# EAGLE design TFT_adapter (EAGLE 7.7.0)
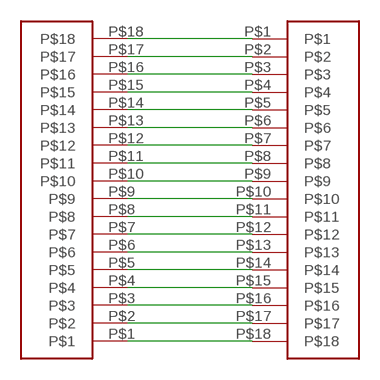
[diagram p0: schematic, sheet 1]

## Parts
U$1  FCC-18-1.0MM  [FFC-18-1.0MM]
U$2  FCC-18-0.8MM  [FFC-18-0.8MM]

## Nets
N$1: U$1.P$18 U$2.P$1
N$2: U$1.P$17 U$2.P$2
N$3: U$1.P$16 U$2.P$3
N$4: U$1.P$15 U$2.P$4
N$5: U$1.P$14 U$2.P$5
N$6: U$1.P$13 U$2.P$6
N$7: U$1.P$12 U$2.P$7
N$8: U$1.P$11 U$2.P$8
N$9: U$1.P$10 U$2.P$9
N$10: U$1.P$9 U$2.P$10
N$11: U$1.P$8 U$2.P$11
N$12: U$1.P$7 U$2.P$12
N$13: U$1.P$6 U$2.P$13
N$14: U$1.P$5 U$2.P$14
N$15: U$1.P$4 U$2.P$15
N$16: U$1.P$3 U$2.P$16
N$17: U$1.P$2 U$2.P$17
N$18: U$1.P$1 U$2.P$18

## Library data of the parts
U$1 = custom:FCC-18-1.0MM
U$2 = custom:FCC-18-0.8MM

## Board
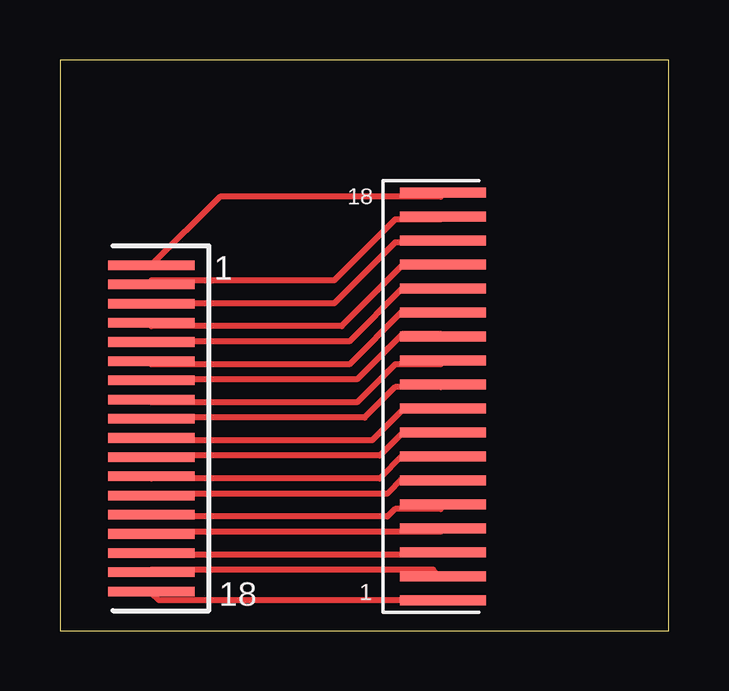
[diagram p1: board, top side]

Size 25.38 x 23.8 mm. Coordinates in mm from the lower left corner, seen from the top.
Outline: 0,0 25.38,0 25.38,23.8 0,23.8 0,0
Copper layers (1*16): Top 0.035mm / dielectric 1.5mm / Bottom 0.035mm
Design rules "default *": minimum track width 10mil, minimum drill 24mil, track to track 12mil, track to pad 12mil, pad to pad 12mil, via to via 12mil, smd to smd 12mil, copper to edge 40mil, drill to drill 8mil, minimum pad ring 10mil, minimum via ring 8mil, stop-mask expansion 4mil, vias tented up to drill 0mil, thermal gap 10mil

### Footprints (pad centres in the part's own frame; a part is rotated, then mirrored left to right if it is on the bottom)
FFC-18-1.0MM = smd 3.6 x 0.4: P$1 2,0; P$2 2,1; P$3 2,2; P$4 2,3; P$5 2,4; P$6 2,5; P$7 2,6; P$8 2,7; P$9 2,8; P$10 2,9; P$11 2,10; P$12 2,11; P$13 2,12; P$14 2,13; P$15 2,14; P$16 2,15; P$17 2,16; P$18 2,17
FFC-18-0.8MM = smd 3.6 x 0.4: P$1 0,0; P$2 0,0.8; P$3 0,1.6; P$4 0,2.4; P$5 0,3.2; P$6 0,4; P$7 0,4.8; P$8 0,5.6; P$9 0,6.4; P$10 0,7.2; P$11 0,8; P$12 0,8.8; P$13 0,9.6; P$14 0,10.4; P$15 0,11.2; P$16 0,12; P$17 0,12.8; P$18 0,13.6

### Placement (x,y rotation side)
U$1  13.97,1.27 0 top
U$2  3.81,15.24 180 top

### Tracks (layer width: path | path; a pad name or v marks a point on that pad's centre or on a via)
N$1
  Top 0.254: U$2.P$1 6.67,18.1 15.88,18.1 U$1.P$18
N$2
  Top 0.254: U$2.P$2 3.81,14.61 11.43,14.61 13.97,17.14 15.88,17.14 U$1.P$17
N$3
  Top 0.254: U$2.P$3 3.81,13.65 11.43,13.65 13.97,16.19 15.88,16.19 U$1.P$16
N$4
  Top 0.254: U$2.P$4 3.81,12.7 11.75,12.7 14.29,15.24 15.88,15.24 U$1.P$15
N$5
  Top 0.254: U$2.P$5 3.81,12.06 12.06,12.06 14.29,14.29 15.88,14.29 U$1.P$14
N$6
  Top 0.254: U$2.P$6 3.81,11.11 12.06,11.11 14.29,13.34 15.88,13.34 U$1.P$13
N$7
  Top 0.254: U$2.P$7 3.81,10.48 12.38,10.48 14.29,12.38 15.88,12.38 U$1.P$12
N$8
  Top 0.254: U$2.P$8 3.81,9.53 12.38,9.53 13.97,11.11 15.88,11.11 U$1.P$11
N$9
  Top 0.254: U$2.P$9 3.81,8.89 12.7,8.89 13.97,10.16 15.88,10.16 U$1.P$10
N$10
  Top 0.254: U$2.P$10 3.81,7.94 13.02,7.94 14.29,9.21 15.88,9.21 U$1.P$9
N$11
  Top 0.254: U$2.P$11 3.81,7.3 13.34,7.3 14.29,8.26 15.88,8.26 U$1.P$8
N$12
  Top 0.254: U$2.P$12 3.81,6.35 13.34,6.35 14.29,7.3 15.88,7.3 U$1.P$7
N$13
  Top 0.254: U$2.P$13 3.81,5.71 13.65,5.71 14.29,6.35 15.88,6.35 U$1.P$6
N$14
  Top 0.254: U$2.P$14 3.81,4.76 13.65,4.76 13.97,5.08 15.88,5.08 U$1.P$5
N$15
  Top 0.254: U$2.P$15 3.81,4.13 15.88,4.13 U$1.P$4
N$16
  Top 0.254: U$2.P$16 3.81,3.17 15.88,3.17 U$1.P$3
N$17
  Top 0.254: U$2.P$17 3.81,2.54 15.56,2.54 15.88,2.22 U$1.P$2
N$18
  Top 0.254: U$1.P$1 4.13,1.27 3.81,1.59 U$2.P$18